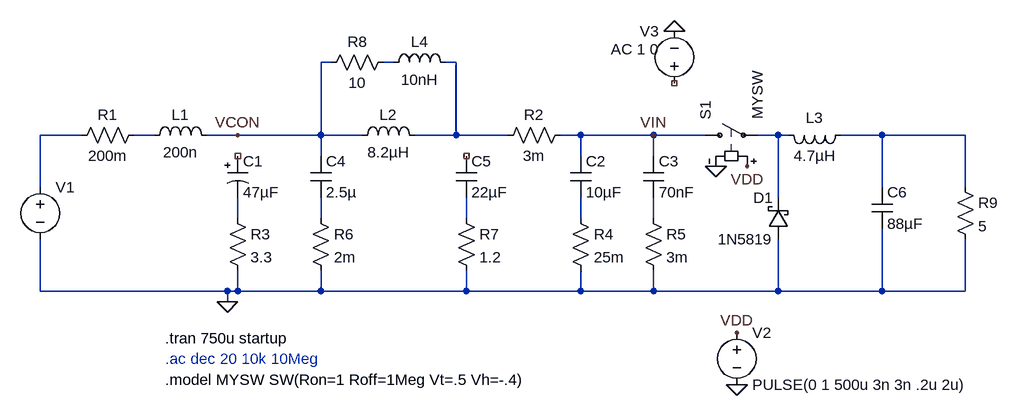
[diagram p0: schematic input_filter_damping.asc]
input_filter_damping.asc, the LTspice schematic file:
Version 4
SHEET 1 1592 680
WIRE 560 0 544 0
WIRE 656 0 640 0
WIRE 752 0 736 0
WIRE 176 112 112 112
WIRE 288 112 256 112
WIRE 416 112 368 112
WIRE 544 112 544 0
WIRE 544 112 416 112
WIRE 608 112 544 112
WIRE 752 112 752 0
WIRE 752 112 688 112
WIRE 832 112 752 112
WIRE 944 112 912 112
WIRE 1056 112 944 112
WIRE 1136 112 1056 112
WIRE 1248 112 1216 112
WIRE 1264 112 1248 112
WIRE 1408 112 1344 112
WIRE 1536 112 1408 112
WIRE 544 144 544 112
WIRE 944 144 944 112
WIRE 1056 144 1056 112
WIRE 112 192 112 112
WIRE 1408 192 1408 112
WIRE 1536 192 1536 112
WIRE 1248 208 1248 112
WIRE 416 240 416 208
WIRE 544 240 544 208
WIRE 768 240 768 208
WIRE 944 240 944 208
WIRE 1056 240 1056 208
WIRE 112 352 112 272
WIRE 400 352 112 352
WIRE 416 352 416 320
WIRE 416 352 400 352
WIRE 544 352 544 320
WIRE 544 352 416 352
WIRE 768 352 768 320
WIRE 768 352 544 352
WIRE 944 352 944 320
WIRE 944 352 768 352
WIRE 1056 352 1056 320
WIRE 1056 352 944 352
WIRE 1248 352 1248 272
WIRE 1248 352 1056 352
WIRE 1408 352 1408 256
WIRE 1408 352 1248 352
WIRE 1536 352 1536 272
WIRE 1536 352 1408 352
WIRE 400 368 400 352
FLAG 400 368 0
FLAG 1056 112 VIN
FLAG 416 112 VCON
FLAG 1152 160 0
FLAG 1184 496 0
FLAG 1200 160 VDD
FLAG 1184 416 VDD
FLAG 1088 -48 0
SYMBOL voltage 112 176 R0
WINDOW 3 24 96 Invisible 2
SYMATTR Value PULSE(0 50 1u 1n 1n 5m 10m)
SYMATTR InstName V1
SYMATTR SpiceLine Rser=5m
SYMBOL res 160 128 R270
WINDOW 0 32 56 VTop 2
WINDOW 3 0 56 VBottom 2
SYMATTR InstName R1
SYMATTR Value 200m
SYMBOL ind 272 128 R270
WINDOW 0 32 56 VTop 2
WINDOW 3 5 56 VBottom 2
SYMATTR InstName L1
SYMATTR Value 200n
SYMBOL polcap 400 144 R0
SYMATTR InstName C1
SYMATTR Value 47µF
SYMBOL res 816 128 R270
WINDOW 0 32 56 VTop 2
WINDOW 3 0 56 VBottom 2
SYMATTR InstName R2
SYMATTR Value 3m
SYMBOL cap 928 144 R0
SYMATTR InstName C2
SYMATTR Value 10µF
SYMBOL cap 1040 144 R0
SYMATTR InstName C3
SYMATTR Value 70nF
SYMBOL res 400 224 R0
SYMATTR InstName R3
SYMATTR Value 3.3
SYMBOL res 928 224 R0
SYMATTR InstName R4
SYMATTR Value 25m
SYMBOL res 1040 224 R0
SYMATTR InstName R5
SYMATTR Value 3m
SYMBOL cap 528 144 R0
SYMATTR InstName C4
SYMATTR Value 2.5µ
SYMBOL res 528 224 R0
SYMATTR InstName R6
SYMATTR Value 2m
SYMBOL ind 592 128 R270
WINDOW 0 32 56 VTop 2
WINDOW 3 5 56 VBottom 2
SYMATTR InstName L2
SYMATTR Value 8.2µH
SYMATTR SpiceLine Ipk=6 Rser=60m
SYMBOL cap 752 144 R0
SYMATTR InstName C5
SYMATTR Value 22µF
SYMBOL res 752 224 R0
SYMATTR InstName R7
SYMATTR Value 1.2
SYMBOL res 656 -16 R90
WINDOW 0 0 56 VBottom 2
WINDOW 3 32 56 VTop 2
SYMATTR InstName R8
SYMATTR Value 10
SYMBOL sw 1120 112 R270
SYMATTR InstName S1
SYMATTR Value MYSW
SYMBOL voltage 1184 400 R0
WINDOW 123 0 0 Left 0
WINDOW 39 0 0 Left 0
SYMATTR InstName V2
SYMATTR Value PULSE(0 1 500u 3n 3n .2u 2u)
SYMBOL ind 1360 96 R90
WINDOW 0 5 56 VBottom 2
WINDOW 3 32 56 VTop 2
SYMATTR InstName L3
SYMATTR Value 4.7µH
SYMBOL cap 1392 192 R0
SYMATTR InstName C6
SYMATTR Value 88µF
SYMBOL res 1520 176 R0
SYMATTR InstName R9
SYMATTR Value 5
SYMBOL schottky 1264 272 R180
WINDOW 0 24 64 Left 2
WINDOW 3 24 0 Left 2
SYMATTR InstName D1
SYMATTR Value 1N5819
SYMATTR Description Diode
SYMATTR Type diode
SYMBOL voltage 1088 48 R180
WINDOW 0 24 96 Left 2
WINDOW 3 24 16 Left 2
WINDOW 123 24 68 Left 2
WINDOW 39 0 0 Left 0
SYMATTR InstName V3
SYMATTR Value ""
SYMATTR Value2 AC 1 0
SYMBOL ind 640 16 R270
WINDOW 0 32 56 VTop 2
WINDOW 3 5 56 VBottom 2
SYMATTR InstName L4
SYMATTR Value 10nH
TEXT 304 424 Left 2 !.tran 750u startup
TEXT 304 456 Left 2 ;.ac dec 20 10k 10Meg
TEXT 304 488 Left 2 !.model MYSW SW(Ron=1 Roff=1Meg Vt=.5 Vh=-.4)

The netlist it stands for:
* input_filter_damping.asc
V1 N003 0 PULSE(0 50 1u 1n 1n 5m 10m) Rser=5m
R1 N003 N004 200m
L1 N004 VCON 200n
C1 NC_01 N007 47µF
R2 N002 VIN 3m
C2 VIN N010 10µF
C3 VIN N011 70nF
R3 N007 0 3.3
R4 N010 0 25m
R5 N011 0 3m
C4 VCON N008 2.5µ
R6 N008 0 2m
L2 VCON N002 8.2µH Ipk=6 Rser=60m
C5 NC_02 N009 22µF
R7 N009 0 1.2
R8 N001 VCON 10
S1 VIN N005 VDD 0 MYSW
V2 VDD 0 PULSE(0 1 500u 3n 3n .2u 2u)
L3 N006 N005 4.7µH
C6 N006 0 88µF
R9 N006 0 5
D1 0 N005 1N5819
V3 NC_03 0 AC 1 0
L4 N001 N002 10nH
.model D D
.lib standard.dio
.tran 750u startup
* .ac dec 20 10k 10Meg
.model MYSW SW(Ron=1 Roff=1Meg Vt=.5 Vh=-.4)
.backanno
.end